# Altium schematic sheet SCH Front Buzzer.SchDoc
size Letter; SheetNumber: 3; SheetTotal: 5
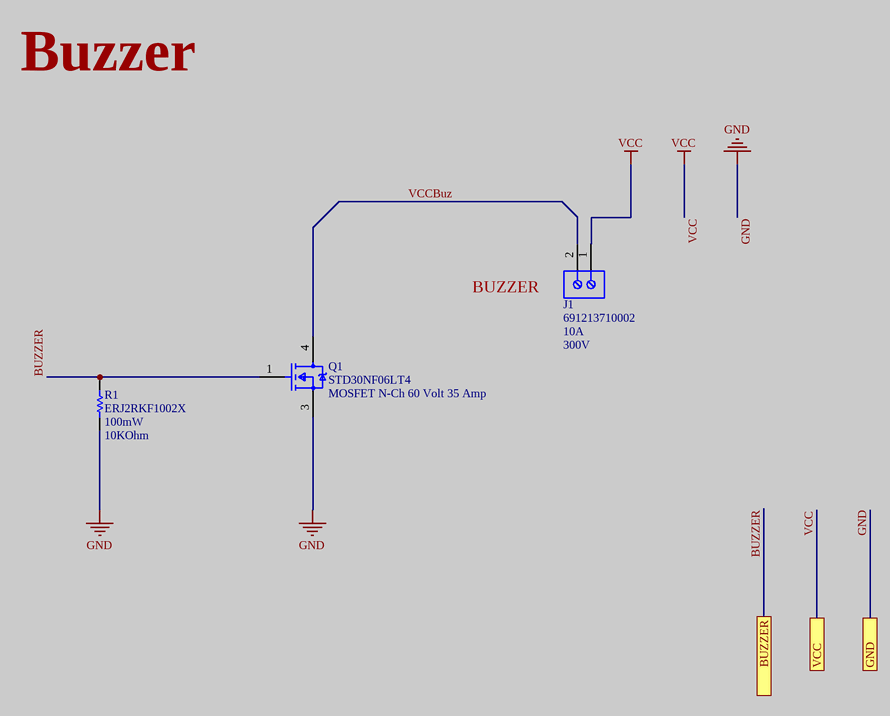
[diagram p0: SCH Front Buzzer.SchDoc]

## Parts
J1  691213710002  Current Rating: 10A  Voltage: 300V  [691213710002]
Q1  STD30NF06LT4  Mouser Description: MOSFET N-Ch 60 Volt 35 Amp  [FP-DPAK-P032P-MFG]
R1  ERJ2RKF1002X  Power Rating: 100mW  Resistance: 10KOhm  [RESC1005X40X25LL05T05]

## Ports
BUZZER, GND, VCC

## Nets
GND: Q1.3(S) R1.1 ; port GND
VCC: J1.1 ; port VCC
BUZZER: Q1.1(G) R1.2 ; port BUZZER
VCCBuz: J1.2 Q1.4(D)

## Notes on the sheet
- Buzzer
- BUZZER

## Library data of the parts
J1 = CMP-1502-02526-2: NexarPartId: 8917718; Number of Contacts: 2; Stripping Length: -7mm; Wire Gauge (Max): 26AWG; Plating: Brass, Steel; Wire Gauge (Min): 16AWG; Number of Levels: 1; Pitch: 5.0038mm; Color: Green; Number of Pins: 2; Housing Material: Nylon; Termination: Screw; Max Operating Temperature: 105°C; Min Operating Temperature: -40°C; Packaging: Box; Current: 10A; REACH SVHC: Unknown; Width: 10.6mm; RoHS: Compliant; Mount: Through Hole; Height: 10mm; Contact Material: Brass; Length: 8.3mm; Lead Pitch: 5mm; Wire/Cable Gauge: 26AWG; Voltage Rating: 300V; Number of Positions Per Level: 2; Contact Plating: Tin
Q1 = CMP-12198-000002-1: MOSFET N-CH 60V 35A DPAK; Manufacturer: STMicroelectronics; Reverse Recovery Charge: 140nC; Power Dissipation: 70W; Number Of N Channels: 1; Depletion Mode: False; Gate To Source Voltage: 20V; Gate Charge At Vgs: 23nC @ 5V; Rthja Max: 100°C/W; Threshold Vgs Max: 2.5V; Input Capacitace At Vds: 1600pF @ 25V; Reverse Recovery Time: 70ns; Transconductance: 25S; Pulse Drain Current: 140A; Max Junction Temp: +175°C; Turn On Delay Time: 30ns; Drain To Source Resistance: 0.022Ω; Turn Off Delay Time: 65ns; Max Forward Diode Voltage: 1.5V; Threshold Vgs Min: 1V; Standoff Height: 0.03mm; ComponentLink2Description: Datasheet; Drain To Source Voltage: 60V; Temperature Range Low: -55°C; Continuous Drain Current: 35A; Lead Free: Yes; Device Class L1: Discrete Semiconductors; Device Class L2: Transistors; Device Class L3: MOSFETs; Temperature: -55°C to +175°C; Digikey Description: MOSFET N-CH 60V 35A DPAK; Octopart: https://octopart.com/std30nf06lt4-stmicroelectronics-39553433; Temperature Range High: +175°C; Number Of Channels: 1; Drain To Source Breakdown Voltage: 60V; Manufacturer Part Number: STD30NF06LT4; RoHS: TRUE; Category: Trans; Automotive: No; Height: 2.63mm; ComponentLink2URL: https://datasheet.ciiva.com/6380/cd00002155-6380412.pdf?src-supplier=Digi-Key; Package: DPAK-P032P
R1 = CMP-2000-07588-1: Chip Resistor, 10 KOhm, +/- 1%, 0.1 W, -55 to 155 degC, 0402 (1005 Metric), RoHS, Tape and Reel; Manufacturer: Panasonic; Voltage Rating: 50V; Case\/Package: 0402; Temperature Coefficient: 100ppm\/degreesC; RoHSCompliant: True; Lead Free: LeadFree; Package Quantity: 1; Contact Plating: Tin; Length: 1mm; Radiation Hardening: No; REACH SVHC: NoSVHC; Max Operating Temperature: 155degC; Depth: 0.5mm; Case Code (Imperial): 0402; Military Standard: Not; Package Description: 2-Pin Surface Mount Device, Body 1 x 0.5 mm; Termination: SMD/SMT; Case Code (Metric): 1005; Height: 0.35mm; Packaging: TapeandReel; Voltage Rating (DC): 50V; Package Reference: 402; Number of Pins: 2; Tolerance: 1%; Mounting Technology: SurfaceMount; Width: 0.02inch; Mount: SurfaceMount; Datasheet URL: https://industrial.panasonic.com/cdbs/www-data/pdf/RDA0000/AOA0000C304.pdf; Composition: ThickFilm; Datasheet Version: 02/2017; Manufacturer URL: http://www.panasonic.com/; Max Power Dissipation: 100mW; Number of Terminations: 2; Min Operating Temperature: -55degC